# Altium schematic sheet Sheet1.SchDoc
size A3; SheetNumber: 1; SheetTotal: 1
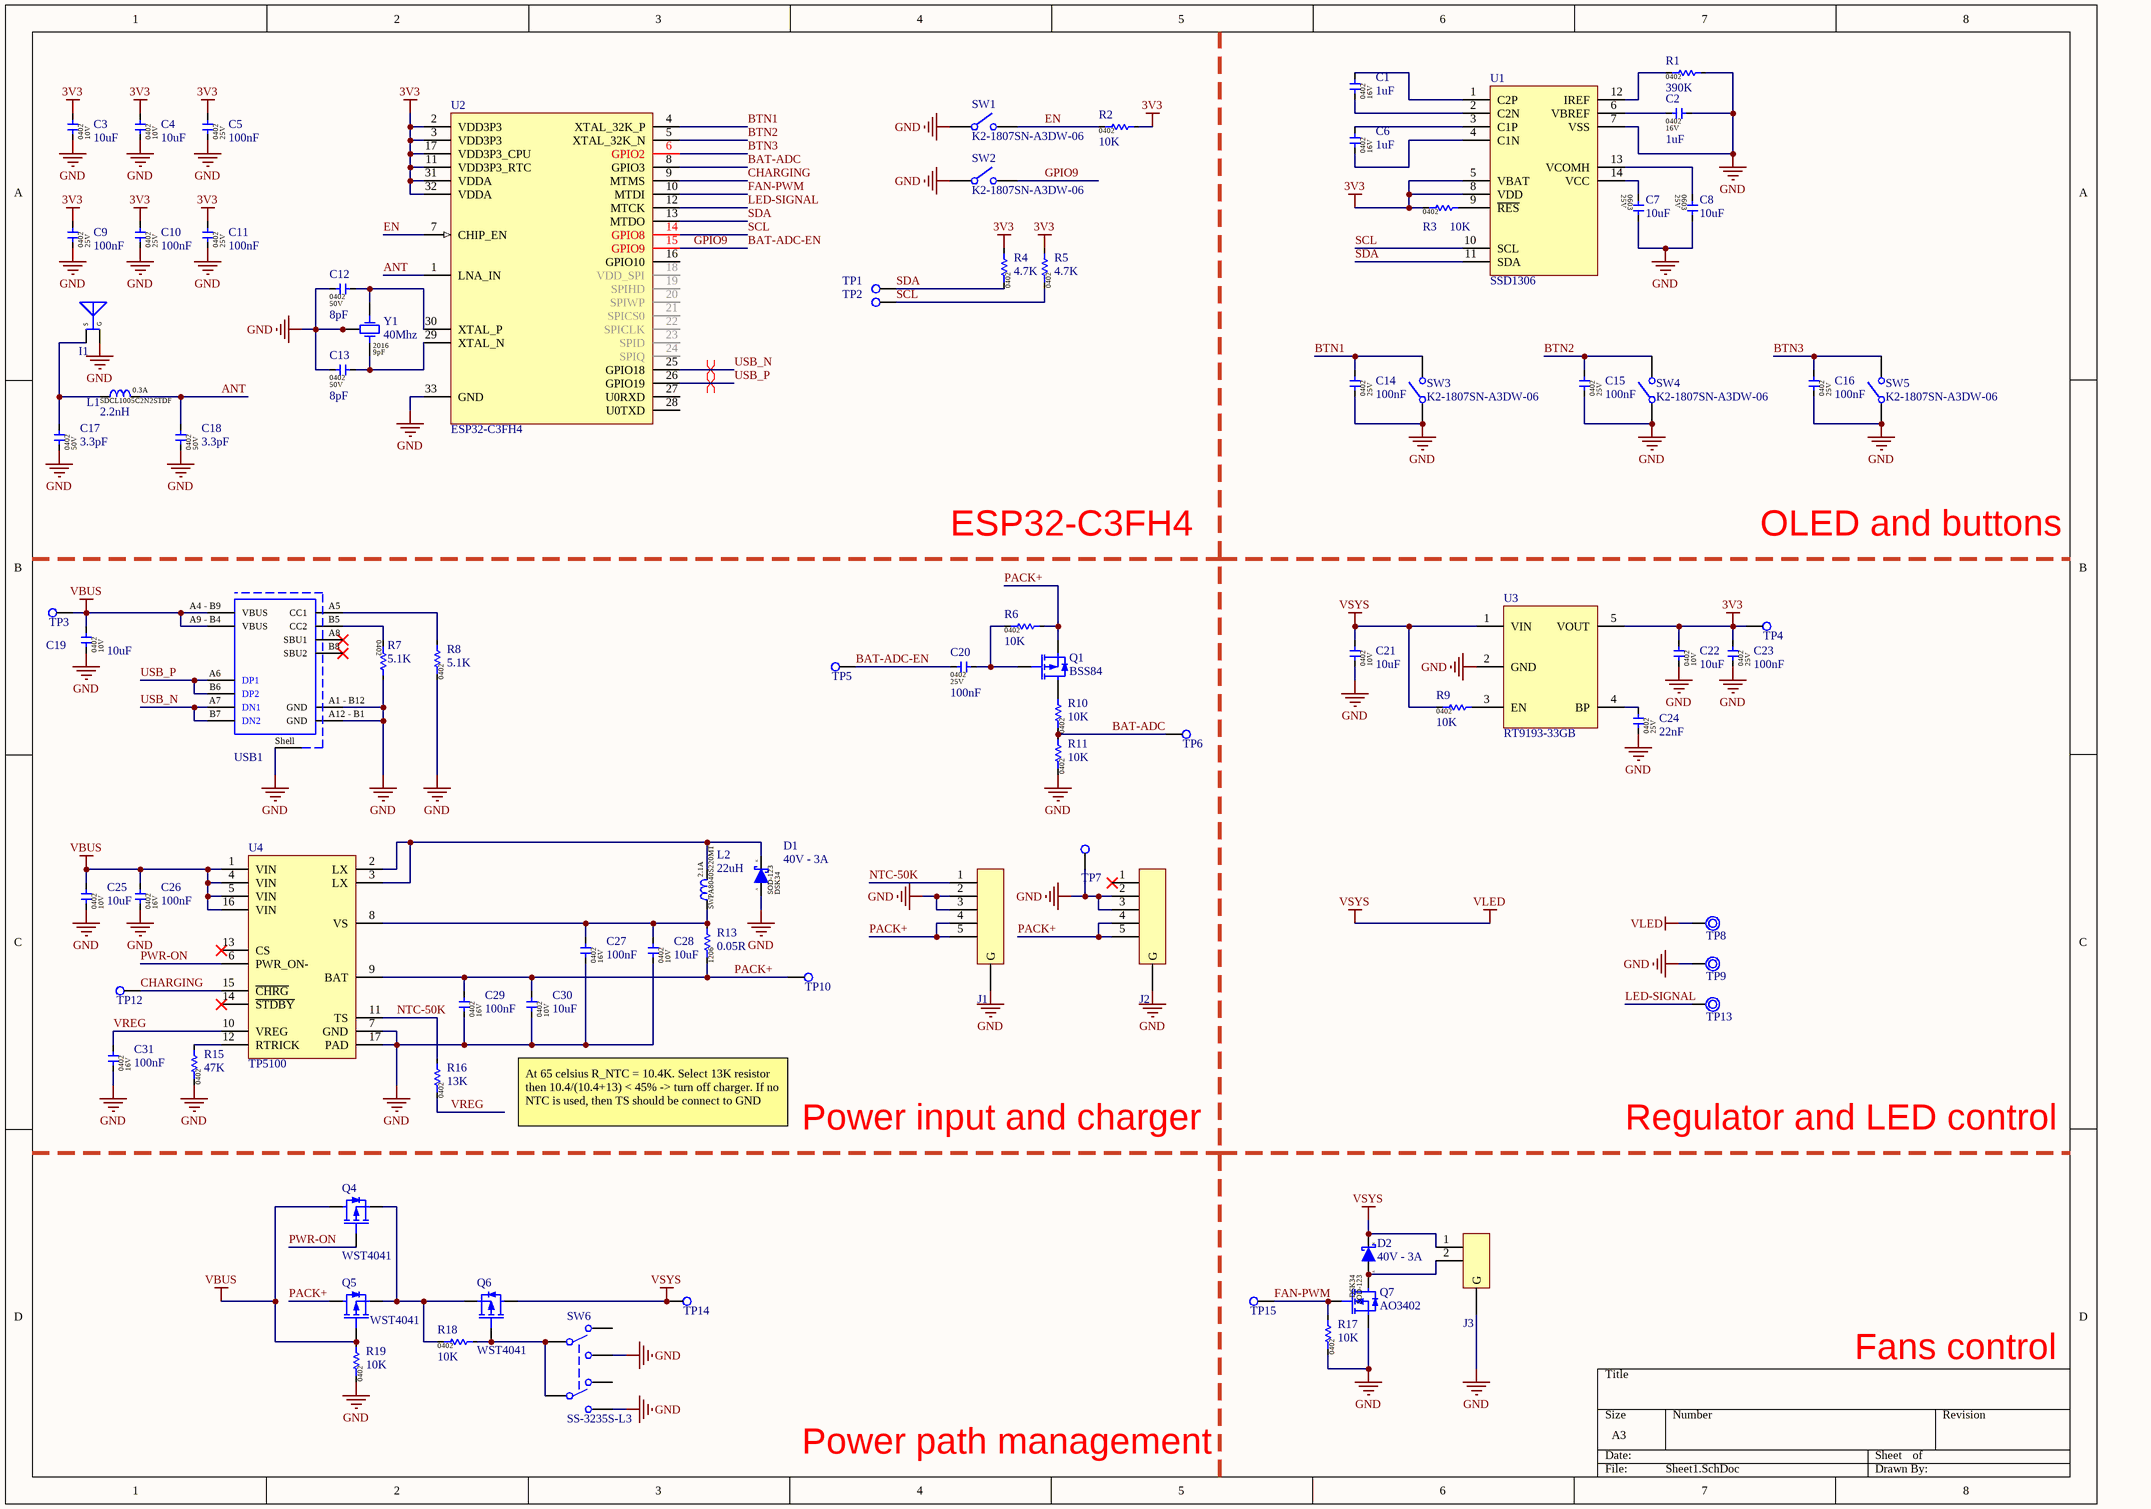
[diagram p0: Sheet1.SchDoc]

## Parts
C1  1uF  [CAP-0402]
C2  1uF  [CAP-0402]
C3  10uF  [CAP-0402]
C4  10uF  [CAP-0402]
C5  100nF  [CAP-0402]
C6  1uF  [CAP-0402]
C7  10uF  [CAP-0603]
C8  10uF  [CAP-0603]
C9  100nF  [CAP-0402]
C10  100nF  [CAP-0402]
C11  100nF  [CAP-0402]
C12  8pF  [CAP-0402]
C13  8pF  [CAP-0402]
C14  100nF  [CAP-0402]
C15  100nF  [CAP-0402]
C16  100nF  [CAP-0402]
C17  3.3pF  [CAP-0402]
C18  3.3pF  [CAP-0402]
C19  10uF  [CAP-0402]
C20  100nF  [CAP-0402]
C21  10uF  [CAP-0402]
C22  10uF  [CAP-0402]
C23  100nF  [CAP-0402]
C24  22nF  [CAP-0402]
C25  10uF  [CAP-0402]
C26  100nF  [CAP-0402]
C27  100nF  [CAP-0402]
C28  10uF  [CAP-0402]
C29  100nF  [CAP-0402]
C30  10uF  [CAP-0402]
C31  100nF  [CAP-0402]
D1  40V - 3A  [SOD123]
D2  40V - 3A  [SOD123]
I1  AN043  [PCB antenna - AN043]  (value not drawn)
J1  20037WR-05  [HY-2.0-5Pin-SMT]  (value not drawn)
J2  20037WR-05  [HY-2.0-5Pin-SMT]  (value not drawn)
J3  ZX-XH2.54-2PLT  [XH-2.54-2Pin-SMT-vertical]  (value not drawn)
L1  2.2nH  [L-0402]
L2  22uH  [IND-8040]
Q1  BSS84  [SOT23-3]
Q4  WST4041  [SOT23-3]
Q5  WST4041  [SOT23-3]
Q6  WST4041  [SOT23-3]
Q7  AO3402  [SOT23-3]
R1  390K  [RES-0402]
R2  10K  [RES-0402]
R3  10K  [RES-0402]
R4  4.7K  [RES-0402]
R5  4.7K  [RES-0402]
R6  10K  [RES-0402]
R7  5.1K  [RES-0402]
R8  5.1K  [RES-0402]
R9  10K  [RES-0402]
R10  10K  [RES-0402]
R11  10K  [RES-0402]
R13  0.05R  [RES-1206]
R15  47K  [RES-0402]
R16  13K  [RES-0402]
R17  10K  [RES-0402]
R18  10K  [RES-0402]
R19  10K  [RES-0402]
SW1  K2-1807SN-A3DW-06  [SW - TYPE 3]
SW2  K2-1807SN-A3DW-06  [SW - TYPE 3]
SW3  K2-1807SN-A3DW-06  [SW - TYPE 3]
SW4  K2-1807SN-A3DW-06  [SW - TYPE 3]
SW5  K2-1807SN-A3DW-06  [SW - TYPE 3]
SW6  SS-3235S-L3  [DPDT - type 1]
TP1  Test point  [Test point]  (value not drawn)  (no BOM)
TP2  Test point  [Test point]  (value not drawn)  (no BOM)
TP3  Test point  [Test point]  (value not drawn)  (no BOM)
TP4  Test point  [Test point]  (value not drawn)  (no BOM)
TP5  Test point  [Test point]  (value not drawn)  (no BOM)
TP6  Test point  [Test point]  (value not drawn)  (no BOM)
TP7  Test point  [Test point]  (value not drawn)  (no BOM)
TP8  Test point hole  [Test point hole]  (value not drawn)  (no BOM)
TP9  Test point hole  [Test point hole]  (value not drawn)  (no BOM)
TP10  Test point  [Test point]  (value not drawn)  (no BOM)
TP12  Test point  [Test point]  (value not drawn)  (no BOM)
TP13  Test point hole  [Test point hole]  (value not drawn)  (no BOM)
TP14  Test point  [Test point]  (value not drawn)  (no BOM)
TP15  Test point  [Test point]  (value not drawn)  (no BOM)
U1  SSD1306  [OLED 0.91 14P]
U2  ESP32-C3FH4  [QFN32-5X5MM_PAD]
U3  RT9193-33GB  [SOT23-5]
U4  TP5100  [QFN16-4X4MM_PAD]
USB1  918-418K2023S40001  [1 FEMALE USB -C 16]  (value not drawn)
Y1  40Mhz  [Crystal-2016]

## Nets
3V3: C3.2 C4.2 C5.2 C9.2 C10.2 C11.2 C22.2 C23.2 R2.2 R3.1 R4.2 R5.2 TP4.1 U1.5(VBAT) U1.8(VDD) U2.2(VDD3P3) U2.3(VDD3P3) U2.11(VDD3P3_RTC) U2.17(VDD3P3_CPU) U2.31(VDDA) U2.32(VDDA) U3.5(VOUT)
GND: C2.2 C3.1 C4.1 C5.1 C7.2 C8.2 C9.1 C10.1 C11.1 C12.1 C13.1 C14.1 C15.1 C16.1 C17.1 C18.1 C19.1 C21.1 C22.1 C23.1 C24.1 C25.1 C26.1 C27.1 C28.1 C29.1 C30.1 C31.1 D1.2(Anode) I1.0(G) J1.0(G) J1.2 J1.3 J2.0(G) J2.2 J2.3 J3.0(G) Q7.2(S) R1.2 R7.2 R8.1 R11.1 R15.1 R17.1 R19.1 SW1.1 SW2.1 SW3.1 SW4.1 SW5.1 SW6.NO1 SW6.NO2 TP7.1 TP9.1 U1.7(VSS) U2.33(GND) U3.2(GND) U4.7(GND) U4.17(PAD) USB1.A1_-_B12(GND) USB1.A12_-_B1(GND) USB1.Shell(Shield) Y1.2(GND) Y1.4(GND)
VBUS: C19.2 C25.2 C26.2 Q4.3(D) Q5.1(G) R19.2 TP3.1 U4.1(VIN) U4.4(VIN) U4.5(VIN) U4.16(VIN) USB1.A4_-_B9(VBUS) USB1.A9_-_B4(VBUS)
VLED: C21.2 D2.1(Cathode) J3.1 Q6.3(D) R9.1 TP8.1 TP14.1 U3.1(VIN)  [also labelled VSYS]
ANT: C18.2 L1.2 U2.1(LNA_IN)
BAT-ADC: R10.1 R11.2 TP6.1 U2.8(GPIO3)
BAT-ADC-EN: C20.1 SW2.2 TP5.1 U2.15(GPIO9)  [also labelled GPIO9]
BTN1: C14.2 SW3.2 U2.4(XTAL_32K_P)
BTN2: C15.2 SW4.2 U2.5(XTAL_32K_N)
BTN3: C16.2 SW5.2 U2.6(GPIO2)
CHARGING: TP12.1 U2.9(MTMS) U4.15(~{CHRG})
EN: R2.1 SW1.2 U2.7(CHIP_EN)
FAN-PWM: Q7.1(G) R17.2 TP15.1 U2.10(MTDI)
LED-SIGNAL: TP13.1 U2.12(MTCK)
NTC-50K: J1.1 R16.2 U4.11(TS)
PACK+: C29.2 C30.2 J1.4 J1.5 J2.4 J2.5 Q1.2(S) Q5.3(D) R6.2 R13.1 TP10.1 U4.9(BAT)
PWR-ON: Q4.1(G) U4.6(PWR_ON-)
SCL: R5.1 TP2.1 U1.10(SCL) U2.14(GPIO8)
SDA: R4.1 TP1.1 U1.11(SDA) U2.13(MTDO)
USB_N: U2.25(GPIO18) USB1.A7(DN1) USB1.B7(DN2)
USB_P: U2.26(GPIO19) USB1.A6(DP1) USB1.B6(DP2)
VREG: C31.2 R16.1 U4.10(VREG)
NetC1_1: C1.1 U1.2(C2N)
NetC1_2: C1.2 U1.1(C2P)
NetC2_1: C2.1 U1.6(VBREF)
NetC6_1: C6.1 U1.4(C1N)
NetC6_2: C6.2 U1.3(C1P)
NetC7_1: C7.1 U1.14(VCC)
NetC8_1: C8.1 U1.13(VCOMH)
NetC12_2: C12.2 U2.30(XTAL_P) Y1.1(X1)
NetC13_2: C13.2 U2.29(XTAL_N) Y1.3(X2)
NetC17_2: C17.2 I1.1(S) L1.1
NetC20_2: C20.2 Q1.1(G) R6.1
NetC24_2: C24.2 U3.4(BP)
NetC27_2: C27.2 C28.2 L2.1 R13.2 U4.8(VS)
NetD1_1: D1.1(Cathode) L2.2 U4.2(LX) U4.3(LX)
NetD2_2: D2.2(Anode) J3.2 Q7.3(D)
NetQ1_3: Q1.3(D) R10.2
NetQ4_2: Q4.2(S) Q5.2(S) Q6.2(S) R18.1
NetQ6_1: Q6.1(G) R18.2 SW6.COM1 SW6.COM2
NetR1_1: R1.1 U1.12(IREF)
NetR3_2: R3.2 U1.9(~{RES})
NetR7_1: R7.1 USB1.B5(CC2)
NetR8_2: R8.2 USB1.A5(CC1)
NetR9_2: R9.2 U3.3(EN)
NetR15_2: R15.2 U4.12(RTRICK)

Not connected (* = marked no-connect by the designer): J2 1*; SW6 NC1 NC2; U2 16(GPIO10) 18(VDD_SPI) 19(SPIHD) 20(SPIWP) 21(SPICS0) 22(SPICLK) 23(SPID) 24(SPIQ) 27(U0RXD) 28(U0TXD); U4 13(CS)* 14(~{STDBY})*; USB1 A8(SBU1)* B8(SBU2)*

## Layout directives
differential pair: USB_N, USB_P

## Notes on the sheet
- ESP32-C3FH4
- OLED and buttons
- At 65 celsius R_NTC = 10.4K. Select 13K resistor then 10.4/(10.4+13) < 45% -> turn off charger. If no NTC is used, then TS should be connect to GND
- Power input and charger
- Regulator and LED control
- Fans control
- Power path management
- (in symbol DSK34) K; A

## Library data of the parts
C1 C2 C6 = 0402X105K160CT: 1uF ±10% 16V X5R 0402 Multilayer Ceramic Capacitors MLCC - SMD/SMT RoHS; Manufacture: WALSIN; Package / Case: 0402; Component type: Capacitor; Manufacture part: 0402X105K160CT; Capacitor value: 1uF; Voltage: 16V; Package: 0402
C3 C4 C19 C21 C22 C25 C28 C30 = CL05A106MP5NUNC: 10V 10uF X5R ±20% 0402 Multilayer Ceramic Capacitors MLCC - SMD/SMT ROHS; Manufacture: Samsung; Package / Case: 0402; Component type: Capacitor; Manufacture part: CL05A106MP5NUNC; Capacitor value: 10uF; Voltage: 10V; Package: 0402
C5 C9-C11 C14-C16 C20 C23 = 0402X104K250CT: 100nF ±10% 25V X5R 0402 Multilayer Ceramic Capacitors MLCC - SMD/SMT RoHS; Manufacture: WALSIN; Package / Case: 0402; Component type: Capacitor; Manufacture part: 0402X104K250CT; Capacitor value: 100nF; Voltage: 25V; Package: 0402
C7 C8 = CL10A106MA8NRNC: 25V 10uF X5R ±20% 0603 Multilayer Ceramic Capacitors MLCC - SMD/SMT ROHS; Manufacture: Samsung Electro-Mechanics; Package / Case: 0402; Component type: Capacitor; Manufacture part: CL10A106MA8NRNC; Capacitor value: 10uF; Voltage: 25V; Package: 0603
C12 C13 = CL05C080DB5NNNC: 8 pF ±0.5pF 50V Ceramic Capacitor C0G, NP0 0402 (1005 Metric); Manufacture: Samsung; Package / Case: 0402; Component type: Capacitor; Manufacture part: CL05C080DB5NNNC; Capacitor value: 8pF; Voltage: 50V; Package: 0402
C17 C18 = 0402N3R3C500CT: 3.3pF ±0.25pF 50V NP0(C0G) 0402 Multilayer Ceramic Capacitors MLCC - SMD/SMT RoHS; Manufacture: WALSIN; Package / Case: 0402; Component type: Capacitor; Manufacture part: 0402N3R3C500CT; Capacitor value: 3.3pF; Voltage: 50V; Package: 0402
C24 = 0402B223K250CT: 22nF ±10% 25V X7R 0402 Multilayer Ceramic Capacitors MLCC - SMD/SMT RoHS; Manufacture: WALSIN; Package / Case: 0402; Component type: Capacitor; Manufacture part: 0402B223K250CT; Capacitor value: 22nF; Voltage: 25V; Package: 0402
C26 C27 C29 C31 = 0402B104K160CT: 100nF ±10% 16V X7R 0402 Multilayer Ceramic Capacitors MLCC - SMD/SMT RoHS; Manufacture: WALSIN; Package / Case: 0402; Component type: Capacitor; Manufacture part: 0402B104K160CT; Capacitor value: 100nF; Voltage: 16V; Package: 0402
D1 D2 = DSK34: 40V 3A 550mV @ 3A SOD-123 Schottky Barrier Diodes (SBD) RoHS; Manufacture part: DSK34; Manufacture: MDD（Microdiode Electronics）; Type: Schottky diode; Diode value: 40V - 3A; Package: SOD-123; Datasheet: https://datasheet.lcsc.com/lcsc/1903051130_MDD-Jiangsu-Yutai-Elec-DSK34_C41029.pdf
I1 = AN043 F-2.4Ghz BW-101Mhz 15x6mm: .Description; Manufacture: N/A; Manufacture part: AN043; Type: PCB Antenna; Datasheet: https://www.ti.com/lit/an/swra351a/swra351a.pdf?ts=1625122688525&ref_url=https%253A%252F%252Fwww.google.com%252F
J1 J2 = 2.0mm 5 Pin Right-Angle 1x5P 2.0mm: .Description; Manufacture: Yeonho; Manufacture part: 20037WR-05; Type: HY2.0; Datasheet: http://topbestech.com/product-pdf/20037WR-NN.pdf
J3 = 1x2P XH 1 2.54mm Tin Male pin 2 260℃ -25℃~+85℃ Brass 3A Brick nogging SMD,P=2.54mm Wire To Board / Wire To Wire Connector ROHS: .Description; Manufacture: Megastar; Manufacture part: ZX-XH2.54-2PLT; Type: XH2.54; Datasheet: https://datasheet.lcsc.com/lcsc/2306191415_Megastar-ZX-XH2-54-2PLT_C7429680.pdf
L1 = SDCL1005C2N2STDF: 300mA 2.2nH 200mΩ 0402 Inductors (SMD) ROHS; Manufacture: SUNLORD; Irms max: 0.3A; DCR: 0.2 Ω; Manufacture part: SDCL1005C2N2STDF; Inductance value: 2.2nH; Package: 0402; Datasheet: https://datasheet.lcsc.com/lcsc/2110081230_Sunlord-SDCL1005C2N2STDF_C27122.pdf
L2 = SWPA8040S220MT: Inductor 22uH ±20% 2.1A, 8.0x8.0x4.0; Manufacture: SUNLORD; DCR: 0.069 Ω; Manufacture part: SWPA8040S220MT; Inductance value: 22uH; Irms max: 2.1A; Package: 8040
Q1 = BSS84: 60V 0.23A 3.5Ω@10V,230mA 350mW 1V@230mA 1PCSPChannel SOT-23 MOSFETs ROHS; Manufacture: UWM; Type: P-Mosfet; Manufacture part: BSS84; Package: SOT23-3; Datasheet: https://datasheet.lcsc.com/lcsc/2311091735_UMW-Youtai-Semiconductor-Co---Ltd--BSS84_C347485.pdf
Q4-Q6 = WST4041: 1.4W 40V 6A 2.2V 250uA P Channel 0.04Ω 3A,10V SOT-23(SOT-23-3) MOSFETs ROHS; Manufacture: Winsok Semicon; Type: P-Mosfet; Manufacture part: WST4041; Package: SOT23-3; Datasheet: https://datasheet.lcsc.com/lcsc/1811012118_Winsok-Semicon-WST4041_C148357.pdf
Q7 = AO3402: N-Channel 30V 4A 1.4V @ 250uA 55mΩ @ 4A,10V 1.4W SOT-23 MOSFETs RoHS; Manufacture: Alpha & Omega Semicon; Type: N-Mosfet; Manufacture part: AO3402; Package: SOT23-3; Datasheet: https://datasheet.lcsc.com/lcsc/Alpha-Omega-Semicon-AOS-AO3402_C14385.pdf
R1 = WR04X3903FTL: ±1% 1/16W 50V ±100ppm/℃ -55℃~+155℃ 390kΩ 0402 Chip Resistor - Surface Mount ROHS; Manufacture: WALSIN; Package / Case: 0201; Component type: Resistor; Manufacture part: WR04X3903FTL; Resistor value: 390K; Package: 0402
R2 R3 R6 R9-R11 R17-R19 = WR04X1002FTL: 10kΩ ±1% 1/16W ±100ppm/℃ 0402 Chip Resistor - Surface Mount RoHS; Manufacture: WALSIN; Package / Case: 0201; Component type: Resistor; Manufacture part: WR04X1002FTL; Resistor value: 10K; Package: 0402
R4 R5 = WR04X4701FTL: 4.7kΩ ±1% 1/16W ±100ppm/℃ 0402 Chip Resistor - Surface Mount RoHS; Manufacture: WALSIN; Package / Case: 0201; Component type: Resistor; Manufacture part: WR04X4701FTL; Resistor value: 4.7K; Package: 0402
R7 R8 = WR04X5101FTL: 5.1kΩ ±1% 1/16W ±100ppm/℃ 0402 Chip Resistor - Surface Mount RoHS; Manufacture: WALSIN; Package / Case: 0201; Component type: Resistor; Manufacture part: WR04X5101FTL; Resistor value: 5.1K; Package: 0402
R13 = LR1206-21R050F4: ±1% 0.05Ω 1W ±50ppm/℃ 1206 Current Sense Resistors/Shunt Resistors ROHS; Manufacture: RALEC; Package / Case: 0201; Component type: Resistor; Manufacture part: LR1206-21R050F4; Resistor value: 0.05R; Package: 1206
R15 = RC0402FR-0747KL: 62.5mW Thick Film Resistors ±100ppm/℃ ±1% 47kΩ 0402 Chip Resistor - Surface Mount ROHS; Manufacture: YAGEO; Package / Case: 0201; Component type: Resistor; Manufacture part: RC0402FR-0747KL; Resistor value: 47K; Package: 0402
R16 = RC0402FR-0713KL: 62.5mW Thick Film Resistors ±100ppm/℃ ±1% 13kΩ 0402 Chip Resistor - Surface Mount ROHS; Manufacture: YAGEO; Package / Case: 0201; Component type: Resistor; Manufacture part: RC0402FR-0713KL; Resistor value: 13K; Package: 0402
SW1-SW5 = SMD,3×4×2.0mm Tactile Switches RoHS: .Description; Manufacture: Korean Hroparts Elec; Manufacture part: K2-1807SN-A3DW-06; Type: Tactile Switches; Datasheet: https://datasheet.lcsc.com/lcsc/2008221234_XUNPU-TS-1088-AR02016_C720477.pdf
SW6 = Brick nogging 50mA DPDT 12V 12V 50mA 10000次 Black SMD Slide Switches ROHS: .Description; Manufacture: XKB Connectivity; Manufacture part: SS-3235S-L3; Type: Slide Switches; Datasheet: https://datasheet.lcsc.com/lcsc/2002271744_XKB-Connectivity-SS-3235S-L3_C381098.pdf
TP1-TP7 TP10 TP12 TP14 TP15 = A pad test point used for measure.: .Description; Manufacture: N/A; Manufacture part: Test point; Type: Test point
TP8 TP9 TP13 = A hole test point used for measure.: .Description; Manufacture: N/A; Manufacture part: Test point hole; Type: Test point hole
U1 = OLED LCD 0.91 inch, 128*32: .Description; Manufacture: N/A; Manufacture part: SSD1306; Type: LCD; Datasheet: http://www.icstation.com/inch-white-oled-display-breakout-board-module-128x32-ssd1306-pins-arduino-p-10865.html
U2 = ESP32-C3FH4: Ultra­Low­Power SoC with RISC­V Single­Core CPU. Supporting IEEE 802.11b/g/n (2.4 GHz Wi­Fi) and Bluetooth® 5 (LE); Manufacture: Espressif Systems; Manufacture part: ESP32-C3FH4; Package: QFN-32 (5x5); Datasheet: https://www.espressif.com/sites/default/files/documentation/esp32-c3_datasheet_en.pdf
U3 = RT9193-33GB: Fixed 5.5V 3.3V 300mV @ 300mA SOT-23-5 Dropout Regulators(LDO) RoHS; Manufacture: Richtek Tech; Manufacture part: RT9193-33GB; Type: LDO; Package: SOT23-5; Datasheet: https://datasheet.lcsc.com/lcsc/Richtek-Tech-RT9193-28GB_C56731.pdf
U4 = TP5100: 1 and 2 cell Li-lon Battery Charger; Manufacture: TOPPOWER; Manufacture part: TP5100; Package: QFN-16 (4x4); Datasheet: https://datasheet.lcsc.com/lcsc/1912111437_TOPPOWER-Nanjing-Extension-Microelectronics-TP5100_C379389.pdf
USB1 = USB - Type C Female 16 SMD USB Connectors RoHS: .Description; Manufacture: Jing Extension of the Electronic Co.; Manufacture part: 918-418K2023S40001; Type: USB-C; Datasheet: https://datasheet.lcsc.com/lcsc/2103051833_Jing-Extension-of-the-Electronic-Co-918-418K2023S40001_C167321.pdf
Y1 = TZ1269D: 40MHz 9pF SMD2016-4P Crystals ROHS; Manufacture: TST; Manufacture part: TZ1269D; Crystal value: 40Mhz; Package: 2016; Load capacitance: 9pF; Datasheet: https://datasheet.lcsc.com/lcsc/2003271435_TST-TZ1269D_C501798.pdf